# EAGLE schematic moxon_915 (EAGLE 9.6.0)
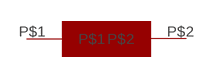
[diagram p0: schematic, sheet 1]

## Parts
U$1  MOXON-915MOX1  [MOXON-915]
Unconnected: U$1.P$1 U$1.P$2

## Library data of the parts
U$1 = wv-antenna:MOXON-915